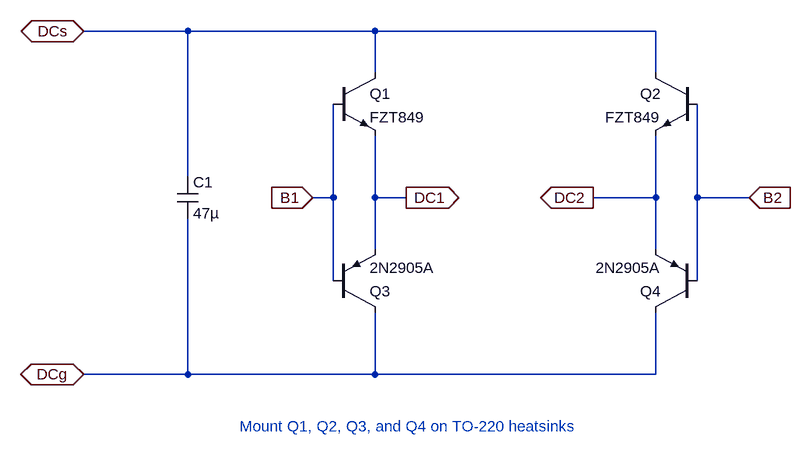
[diagram p0: schematic MotorDriver.asc]
MotorDriver.asc, the LTspice schematic file:
Version 4
SHEET 1 1260 776
WIRE 320 96 160 96
WIRE 608 96 320 96
WIRE 1040 96 608 96
WIRE 608 160 608 96
WIRE 1040 160 1040 96
WIRE 320 320 320 96
WIRE 544 352 544 208
WIRE 544 352 512 352
WIRE 608 352 608 256
WIRE 656 352 608 352
WIRE 1040 352 1040 256
WIRE 1040 352 944 352
WIRE 1104 352 1104 208
WIRE 1184 352 1104 352
WIRE 608 432 608 352
WIRE 1040 432 1040 352
WIRE 544 480 544 352
WIRE 1104 480 1104 352
WIRE 320 624 320 384
WIRE 320 624 160 624
WIRE 608 624 608 528
WIRE 608 624 320 624
WIRE 1040 624 1040 528
WIRE 1040 624 608 624
FLAG 512 352 B1
IOPIN 512 352 In
FLAG 160 96 DCs
IOPIN 160 96 BiDir
FLAG 160 624 DCg
IOPIN 160 624 BiDir
FLAG 1184 352 B2
IOPIN 1184 352 In
FLAG 656 352 DC1
IOPIN 656 352 Out
FLAG 944 352 DC2
IOPIN 944 352 Out
SYMBOL cap 304 320 R0
SYMATTR InstName C1
SYMATTR Value 47µ
SYMBOL npn 544 160 R0
SYMATTR InstName Q1
SYMATTR Value FZT849
SYMBOL pnp 544 528 M180
SYMATTR InstName Q3
SYMATTR Value 2N2905A
SYMBOL npn 1104 160 M0
SYMATTR InstName Q2
SYMATTR Value FZT849
SYMBOL pnp 1104 528 R180
SYMATTR InstName Q4
SYMATTR Value 2N2905A
TEXT 400 704 Left 2 ;Mount Q1, Q2, Q3, and Q4 on TO-220 heatsinks

The netlist it stands for:
* MotorDriver.asc
C1 DCs DCg 47µ
Q1 DCs B1 DC1 0 FZT849
Q3 DCg B1 DC1 0 2N2905A
Q2 DCs B2 DC2 0 FZT849
Q4 DCg B2 DC2 0 2N2905A
.model NPN NPN
.model PNP PNP
.lib standard.bjt
* Mount Q1, Q2, Q3, and Q4 on TO-220 heatsinks
.backanno
.end